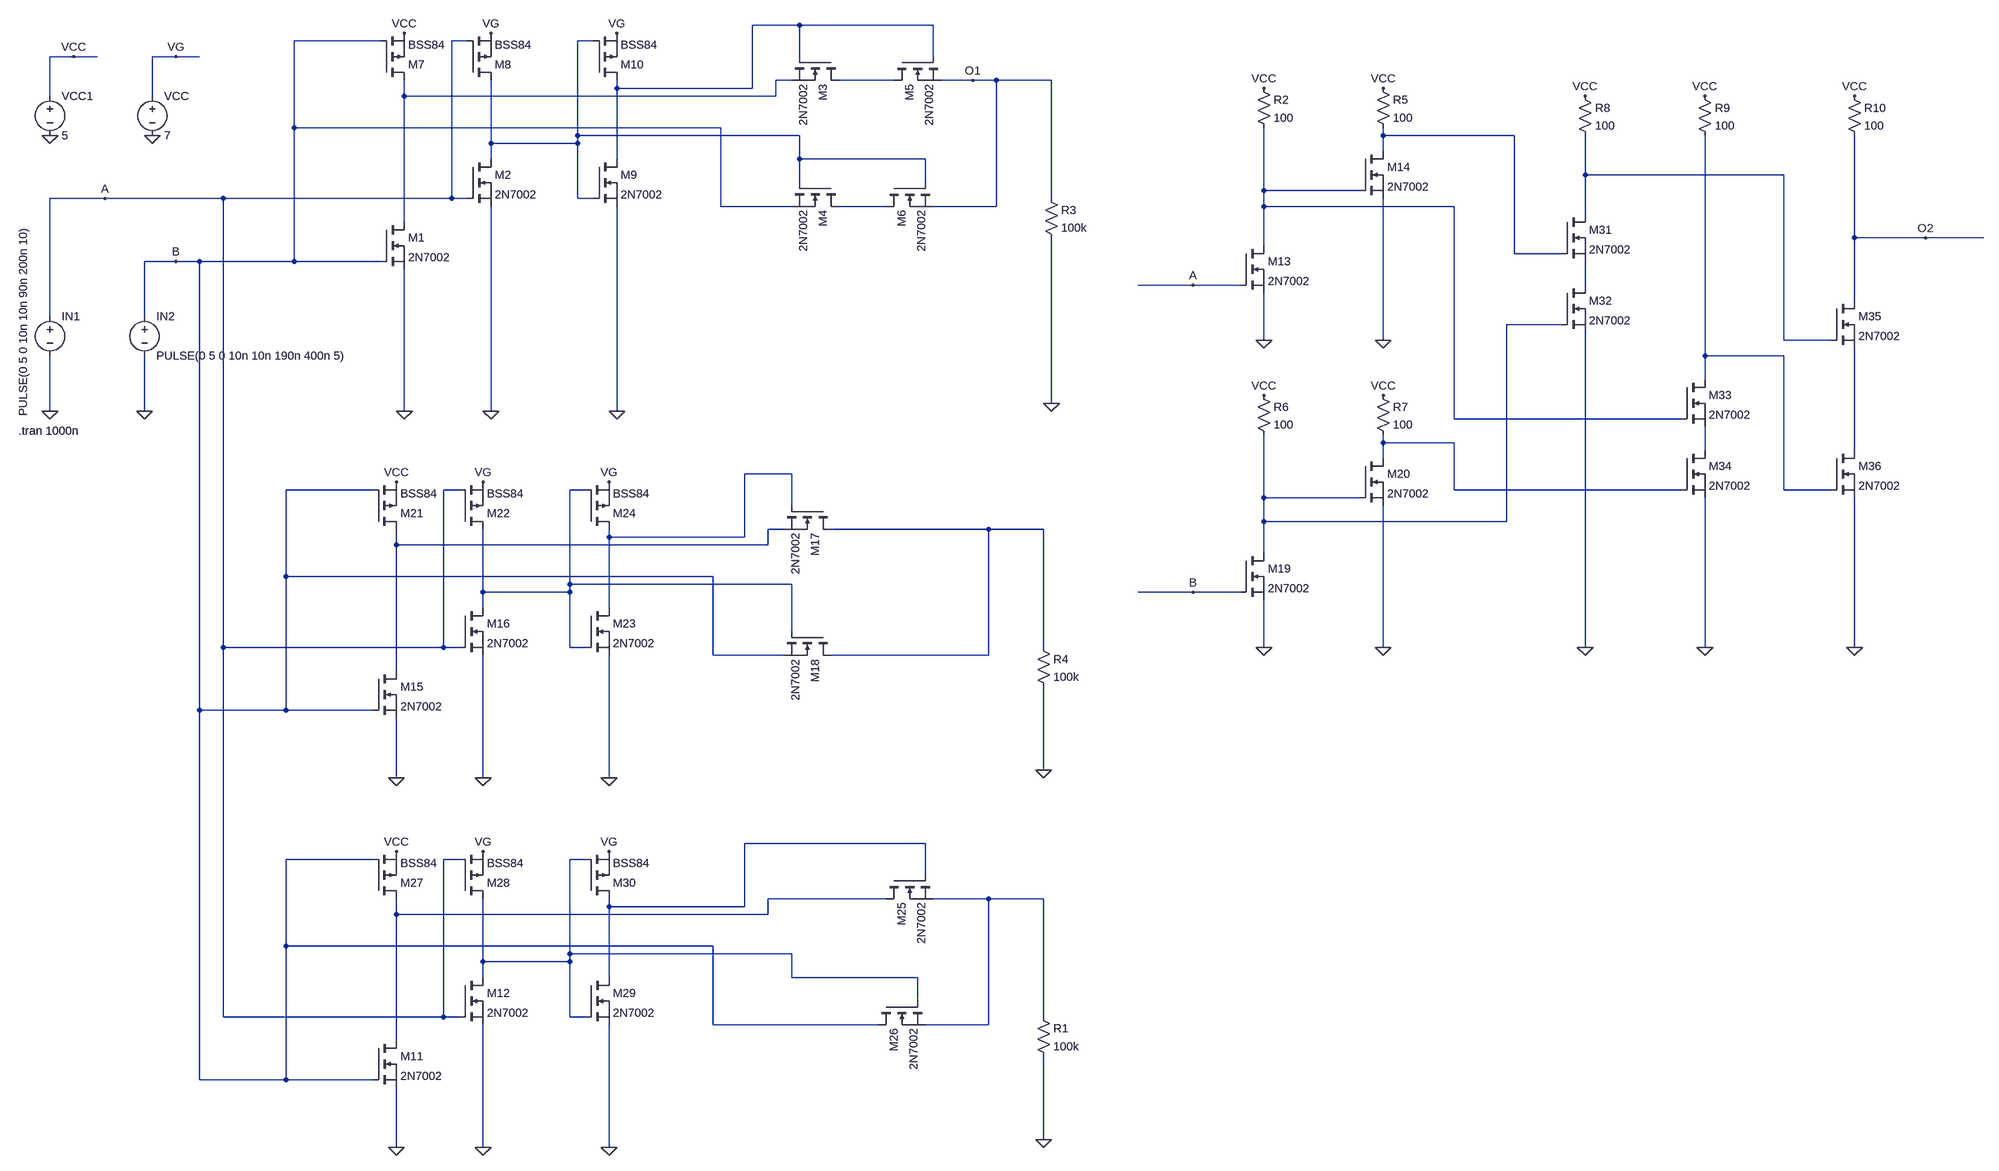
[diagram p0: schematic xor.asc]
xor.asc, the LTspice schematic file:
Version 4.1
SHEET 1 4404 2596
WIRE 1456 -64 1360 -64
WIRE 1728 -64 1456 -64
WIRE 560 -32 384 -32
WIRE 736 -32 704 -32
WIRE 992 -32 960 -32
WIRE -64 0 -112 0
WIRE -16 0 -64 0
WIRE 144 0 96 0
WIRE 192 0 144 0
WIRE 1456 0 1456 -64
WIRE 1728 0 1728 -64
WIRE 1440 48 1408 48
WIRE 1648 48 1536 48
WIRE 1808 48 1744 48
WIRE 1856 48 1808 48
WIRE 1968 48 1856 48
WIRE 1040 64 1040 48
WIRE 1360 64 1360 -64
WIRE 1360 64 1040 64
WIRE -112 80 -112 0
WIRE 96 80 96 0
WIRE 608 80 608 48
WIRE 1408 80 1408 48
WIRE 1408 80 608 80
WIRE 384 144 384 -32
WIRE 1296 144 384 144
WIRE 960 160 960 -32
WIRE 1456 160 960 160
WIRE 3072 160 3072 144
WIRE 3360 160 3072 160
WIRE 784 176 784 48
WIRE 960 176 960 160
WIRE 960 176 784 176
WIRE 3072 192 3072 160
WIRE 784 208 784 176
WIRE 1040 208 1040 64
WIRE 1456 208 1456 160
WIRE 1712 208 1456 208
WIRE 3504 240 3504 160
WIRE 3984 240 3504 240
WIRE 1456 256 1456 208
WIRE 1712 256 1712 208
WIRE 2768 272 2768 144
WIRE 3024 272 2768 272
WIRE 0 288 -112 288
WIRE 240 288 0 288
WIRE 704 288 704 -32
WIRE 704 288 240 288
WIRE 736 288 704 288
WIRE 960 288 960 176
WIRE 992 288 960 288
WIRE 1968 288 1968 48
WIRE 1296 304 1296 144
WIRE 1440 304 1296 304
WIRE 1632 304 1536 304
WIRE 1856 304 1856 48
WIRE 1856 304 1728 304
WIRE 2768 304 2768 272
WIRE 3216 304 2768 304
WIRE 3504 320 3504 240
WIRE 608 336 608 80
WIRE 4128 368 4128 160
WIRE 4272 368 4128 368
WIRE 4400 368 4272 368
WIRE 2768 384 2768 304
WIRE 3360 400 3360 160
WIRE 3456 400 3360 400
WIRE 144 416 80 416
WIRE 192 416 144 416
WIRE 384 416 384 144
WIRE 384 416 192 416
WIRE 560 416 384 416
WIRE 2624 464 2512 464
WIRE 2720 464 2624 464
WIRE 3504 464 3504 416
WIRE 4128 496 4128 368
WIRE -112 528 -112 288
WIRE 80 528 80 416
WIRE 3456 544 3344 544
WIRE 2768 576 2768 480
WIRE 3072 576 3072 288
WIRE 3984 576 3984 240
WIRE 4080 576 3984 576
WIRE 3824 608 3824 160
WIRE 3984 608 3824 608
WIRE 3824 656 3824 608
WIRE 1968 704 1968 368
WIRE -112 720 -112 608
WIRE 80 720 80 608
WIRE 608 720 608 432
WIRE 784 720 784 304
WIRE 1040 720 1040 304
WIRE 3216 736 3216 304
WIRE 3776 736 3216 736
WIRE 3072 784 3072 768
WIRE 3216 784 3072 784
WIRE 3824 800 3824 752
WIRE 4128 800 4128 592
WIRE 3072 816 3072 784
WIRE 1440 848 1344 848
WIRE 544 880 368 880
WIRE 720 880 688 880
WIRE 976 880 944 880
WIRE 3216 880 3216 784
WIRE 3776 880 3216 880
WIRE 3984 880 3984 608
WIRE 4080 880 3984 880
WIRE 2768 896 2768 768
WIRE 3024 896 2768 896
WIRE 1440 912 1440 848
WIRE 2768 944 2768 896
WIRE 3344 944 3344 544
WIRE 3344 944 2768 944
WIRE 1424 960 1392 960
WIRE 1840 960 1520 960
WIRE 1952 960 1840 960
WIRE 1024 976 1024 960
WIRE 1344 976 1344 848
WIRE 1344 976 1024 976
WIRE 592 992 592 960
WIRE 1392 992 1392 960
WIRE 1392 992 592 992
WIRE 2768 1008 2768 944
WIRE 368 1056 368 880
WIRE 1280 1056 368 1056
WIRE 944 1072 944 880
WIRE 1440 1072 944 1072
WIRE 768 1088 768 960
WIRE 944 1088 944 1072
WIRE 944 1088 768 1088
WIRE 2624 1088 2512 1088
WIRE 2720 1088 2624 1088
WIRE 768 1120 768 1088
WIRE 1024 1120 1024 976
WIRE 1440 1168 1440 1072
WIRE 240 1200 240 288
WIRE 688 1200 688 880
WIRE 688 1200 240 1200
WIRE 720 1200 688 1200
WIRE 944 1200 944 1088
WIRE 976 1200 944 1200
WIRE 1952 1200 1952 960
WIRE 2768 1200 2768 1104
WIRE 3072 1200 3072 912
WIRE 3504 1200 3504 560
WIRE 3824 1200 3824 896
WIRE 4128 1200 4128 896
WIRE 1280 1216 1280 1056
WIRE 1424 1216 1280 1216
WIRE 1840 1216 1840 960
WIRE 1840 1216 1520 1216
WIRE 592 1248 592 992
WIRE 192 1328 192 416
WIRE 368 1328 368 1056
WIRE 368 1328 192 1328
WIRE 544 1328 368 1328
WIRE 1952 1616 1952 1280
WIRE 592 1632 592 1344
WIRE 768 1632 768 1216
WIRE 1024 1632 1024 1216
WIRE 1712 1792 1344 1792
WIRE 544 1824 368 1824
WIRE 720 1824 688 1824
WIRE 976 1824 944 1824
WIRE 1712 1856 1712 1792
WIRE 1632 1904 1392 1904
WIRE 1840 1904 1728 1904
WIRE 1952 1904 1840 1904
WIRE 1024 1920 1024 1904
WIRE 1344 1920 1344 1792
WIRE 1344 1920 1024 1920
WIRE 592 1936 592 1904
WIRE 1392 1936 1392 1904
WIRE 1392 1936 592 1936
WIRE 368 2000 368 1824
WIRE 1280 2000 368 2000
WIRE 944 2016 944 1824
WIRE 1440 2016 944 2016
WIRE 768 2032 768 1904
WIRE 944 2032 944 2016
WIRE 944 2032 768 2032
WIRE 768 2064 768 2032
WIRE 1024 2064 1024 1920
WIRE 1440 2064 1440 2016
WIRE 1696 2064 1440 2064
WIRE 1696 2112 1696 2064
WIRE 240 2144 240 1200
WIRE 688 2144 688 1824
WIRE 688 2144 240 2144
WIRE 720 2144 688 2144
WIRE 944 2144 944 2032
WIRE 976 2144 944 2144
WIRE 1952 2144 1952 1904
WIRE 1280 2160 1280 2000
WIRE 1616 2160 1280 2160
WIRE 1840 2160 1840 1904
WIRE 1840 2160 1712 2160
WIRE 592 2192 592 1936
WIRE 192 2272 192 1328
WIRE 368 2272 368 2000
WIRE 368 2272 192 2272
WIRE 544 2272 368 2272
WIRE 1952 2560 1952 2224
WIRE 592 2576 592 2288
WIRE 768 2576 768 2160
WIRE 1024 2576 1024 2160
FLAG 608 720 0
FLAG 784 720 0
FLAG 96 160 0
FLAG 144 0 VG
FLAG 608 -48 VCC
FLAG 784 -48 VG
FLAG 1968 704 0
FLAG 80 720 0
FLAG -112 720 0
FLAG 1040 720 0
FLAG 1040 -48 VG
FLAG -112 160 0
FLAG -64 0 VCC
FLAG 592 1632 0
FLAG 768 1632 0
FLAG 592 864 VCC
FLAG 768 864 VG
FLAG 1952 1616 0
FLAG 1024 1632 0
FLAG 1024 864 VG
FLAG 592 2576 0
FLAG 768 2576 0
FLAG 592 1808 VCC
FLAG 768 1808 VG
FLAG 1952 2560 0
FLAG 1024 2576 0
FLAG 1024 1808 VG
FLAG 2768 64 VCC
FLAG 2768 576 0
FLAG 0 288 A
FLAG 144 416 B
FLAG 1808 48 O1
FLAG 3072 64 VCC
FLAG 3072 576 0
FLAG 2624 464 A
FLAG 2768 688 VCC
FLAG 2768 1200 0
FLAG 3072 688 VCC
FLAG 3072 1200 0
FLAG 2624 1088 B
FLAG 3504 80 VCC
FLAG 3504 1200 0
FLAG 3824 80 VCC
FLAG 3824 1200 0
FLAG 4128 80 VCC
FLAG 4128 1200 0
FLAG 4272 368 O2
SYMBOL voltage 96 64 R0
WINDOW 123 0 0 Left 0
WINDOW 39 0 0 Left 0
SYMATTR InstName VCC
SYMATTR Value 7
SYMBOL nmos 560 336 R0
SYMATTR InstName M1
SYMATTR Value 2N7002
SYMBOL nmos 736 208 R0
SYMATTR InstName M2
SYMATTR Value 2N7002
SYMBOL nmos 1536 0 R90
SYMATTR InstName M3
SYMATTR Value 2N7002
SYMBOL nmos 1536 256 R90
SYMATTR InstName M4
SYMATTR Value 2N7002
SYMBOL nmos 1648 0 M90
SYMATTR InstName M5
SYMATTR Value 2N7002
SYMBOL nmos 1632 256 M90
SYMATTR InstName M6
SYMATTR Value 2N7002
SYMBOL res 1952 272 R0
SYMATTR InstName R3
SYMATTR Value 100k
SYMBOL voltage -112 512 R0
WINDOW 3 -54 -166 VRight 2
WINDOW 123 0 0 Left 0
WINDOW 39 0 0 Left 0
SYMATTR Value PULSE(0 5 0 10n 10n 90n 200n 10)
SYMATTR InstName IN1
SYMBOL voltage 80 512 R0
WINDOW 123 0 0 Left 0
WINDOW 39 0 0 Left 0
SYMATTR InstName IN2
SYMATTR Value PULSE(0 5 0 10n 10n 190n 400n 5)
SYMBOL pmos 560 48 M180
SYMATTR InstName M7
SYMATTR Value BSS84
SYMBOL pmos 736 48 M180
SYMATTR InstName M8
SYMATTR Value BSS84
SYMBOL nmos 992 208 R0
SYMATTR InstName M9
SYMATTR Value 2N7002
SYMBOL pmos 992 48 M180
SYMATTR InstName M10
SYMATTR Value BSS84
SYMBOL voltage -112 64 R0
WINDOW 123 0 0 Left 0
WINDOW 39 0 0 Left 0
SYMATTR InstName VCC1
SYMATTR Value 5
SYMBOL nmos 544 1248 R0
SYMATTR InstName M15
SYMATTR Value 2N7002
SYMBOL nmos 720 1120 R0
SYMATTR InstName M16
SYMATTR Value 2N7002
SYMBOL nmos 1520 912 R90
SYMATTR InstName M17
SYMATTR Value 2N7002
SYMBOL nmos 1520 1168 R90
SYMATTR InstName M18
SYMATTR Value 2N7002
SYMBOL res 1936 1184 R0
SYMATTR InstName R4
SYMATTR Value 100k
SYMBOL pmos 544 960 M180
SYMATTR InstName M21
SYMATTR Value BSS84
SYMBOL pmos 720 960 M180
SYMATTR InstName M22
SYMATTR Value BSS84
SYMBOL nmos 976 1120 R0
SYMATTR InstName M23
SYMATTR Value 2N7002
SYMBOL pmos 976 960 M180
SYMATTR InstName M24
SYMATTR Value BSS84
SYMBOL nmos 544 2192 R0
SYMATTR InstName M11
SYMATTR Value 2N7002
SYMBOL nmos 720 2064 R0
SYMATTR InstName M12
SYMATTR Value 2N7002
SYMBOL nmos 1632 1856 M90
SYMATTR InstName M25
SYMATTR Value 2N7002
SYMBOL nmos 1616 2112 M90
SYMATTR InstName M26
SYMATTR Value 2N7002
SYMBOL res 1936 2128 R0
SYMATTR InstName R1
SYMATTR Value 100k
SYMBOL pmos 544 1904 M180
SYMATTR InstName M27
SYMATTR Value BSS84
SYMBOL pmos 720 1904 M180
SYMATTR InstName M28
SYMATTR Value BSS84
SYMBOL nmos 976 2064 R0
SYMATTR InstName M29
SYMATTR Value 2N7002
SYMBOL pmos 976 1904 M180
SYMATTR InstName M30
SYMATTR Value BSS84
SYMBOL nmos 2720 384 R0
SYMATTR InstName M13
SYMATTR Value 2N7002
SYMBOL res 2752 48 R0
SYMATTR InstName R2
SYMATTR Value 100
SYMBOL nmos 3024 192 R0
SYMATTR InstName M14
SYMATTR Value 2N7002
SYMBOL res 3056 48 R0
SYMATTR InstName R5
SYMATTR Value 100
SYMBOL nmos 2720 1008 R0
SYMATTR InstName M19
SYMATTR Value 2N7002
SYMBOL res 2752 672 R0
SYMATTR InstName R6
SYMATTR Value 100
SYMBOL nmos 3024 816 R0
SYMATTR InstName M20
SYMATTR Value 2N7002
SYMBOL res 3056 672 R0
SYMATTR InstName R7
SYMATTR Value 100
SYMBOL nmos 3456 320 R0
SYMATTR InstName M31
SYMATTR Value 2N7002
SYMBOL nmos 3456 464 R0
SYMATTR InstName M32
SYMATTR Value 2N7002
SYMBOL res 3488 64 R0
SYMATTR InstName R8
SYMATTR Value 100
SYMBOL nmos 3776 656 R0
SYMATTR InstName M33
SYMATTR Value 2N7002
SYMBOL nmos 3776 800 R0
SYMATTR InstName M34
SYMATTR Value 2N7002
SYMBOL res 3808 64 R0
SYMATTR InstName R9
SYMATTR Value 100
SYMBOL nmos 4080 496 R0
SYMATTR InstName M35
SYMATTR Value 2N7002
SYMBOL nmos 4080 800 R0
SYMATTR InstName M36
SYMATTR Value 2N7002
SYMBOL res 4112 64 R0
SYMATTR InstName R10
SYMATTR Value 100
TEXT -176 760 Left 2 !.tran 1000n

The netlist it stands for:
* xor.asc
VCC VG 0 7
M1 N003 B 0 0 2N7002
M2 N002 A 0 0 2N7002
M3 N004 N001 N003 N003 2N7002
M4 N008 N002 B B 2N7002
M5 N004 N001 O1 O1 2N7002
M6 N008 N002 O1 O1 2N7002
R3 O1 0 100k
V§IN1 A 0 PULSE(0 5 0 10n 10n 90n 200n 10)
V§IN2 B 0 PULSE(0 5 0 10n 10n 190n 400n 5)
M7 N003 B VCC VCC BSS84
M8 N002 A VG VG BSS84
M9 N001 N002 0 0 2N7002
M10 N001 N002 VG VG BSS84
VCC1 VCC 0 5
M15 N017 B 0 0 2N7002
M16 N016 A 0 0 2N7002
M17 N018 N015 N017 N017 2N7002
M18 N018 N016 B B 2N7002
R4 N018 0 100k
M21 N017 B VCC VCC BSS84
M22 N016 A VG VG BSS84
M23 N015 N016 0 0 2N7002
M24 N015 N016 VG VG BSS84
M11 N021 B 0 0 2N7002
M12 N020 A 0 0 2N7002
M25 N021 N019 N022 N022 2N7002
M26 B N020 N022 N022 2N7002
R1 N022 0 100k
M27 N021 B VCC VCC BSS84
M28 N020 A VG VG BSS84
M29 N019 N020 0 0 2N7002
M30 N019 N020 VG VG BSS84
M13 N007 A 0 0 2N7002
R2 VCC N007 100
M14 N005 N007 0 0 2N7002
R5 VCC N005 100
M19 N010 B 0 0 2N7002
R6 VCC N010 100
M20 N012 N010 0 0 2N7002
R7 VCC N012 100
M31 N006 N005 N009 N009 2N7002
M32 N009 N010 0 0 2N7002
R8 VCC N006 100
M33 N011 N007 N013 N013 2N7002
M34 N013 N012 0 0 2N7002
R9 VCC N011 100
M35 O2 N006 N014 N014 2N7002
M36 N014 N011 0 0 2N7002
R10 VCC O2 100
.model NMOS NMOS
.model PMOS PMOS
.lib standard.mos
.tran 1000n
.backanno
.end